# Altium schematic sheet CON_NB3000_ATE_INTF.SchDoc: ATE Interface Connector
size A4; Organization: Altium Limited.; Address1: Level 3, 12a Rodborough Rd; Address2: Frenchs Forest 2086; Address3: NSW; Address4: AUSTRALIA; DocumentNumber: 56; SheetNumber: 57; SheetTotal: 77
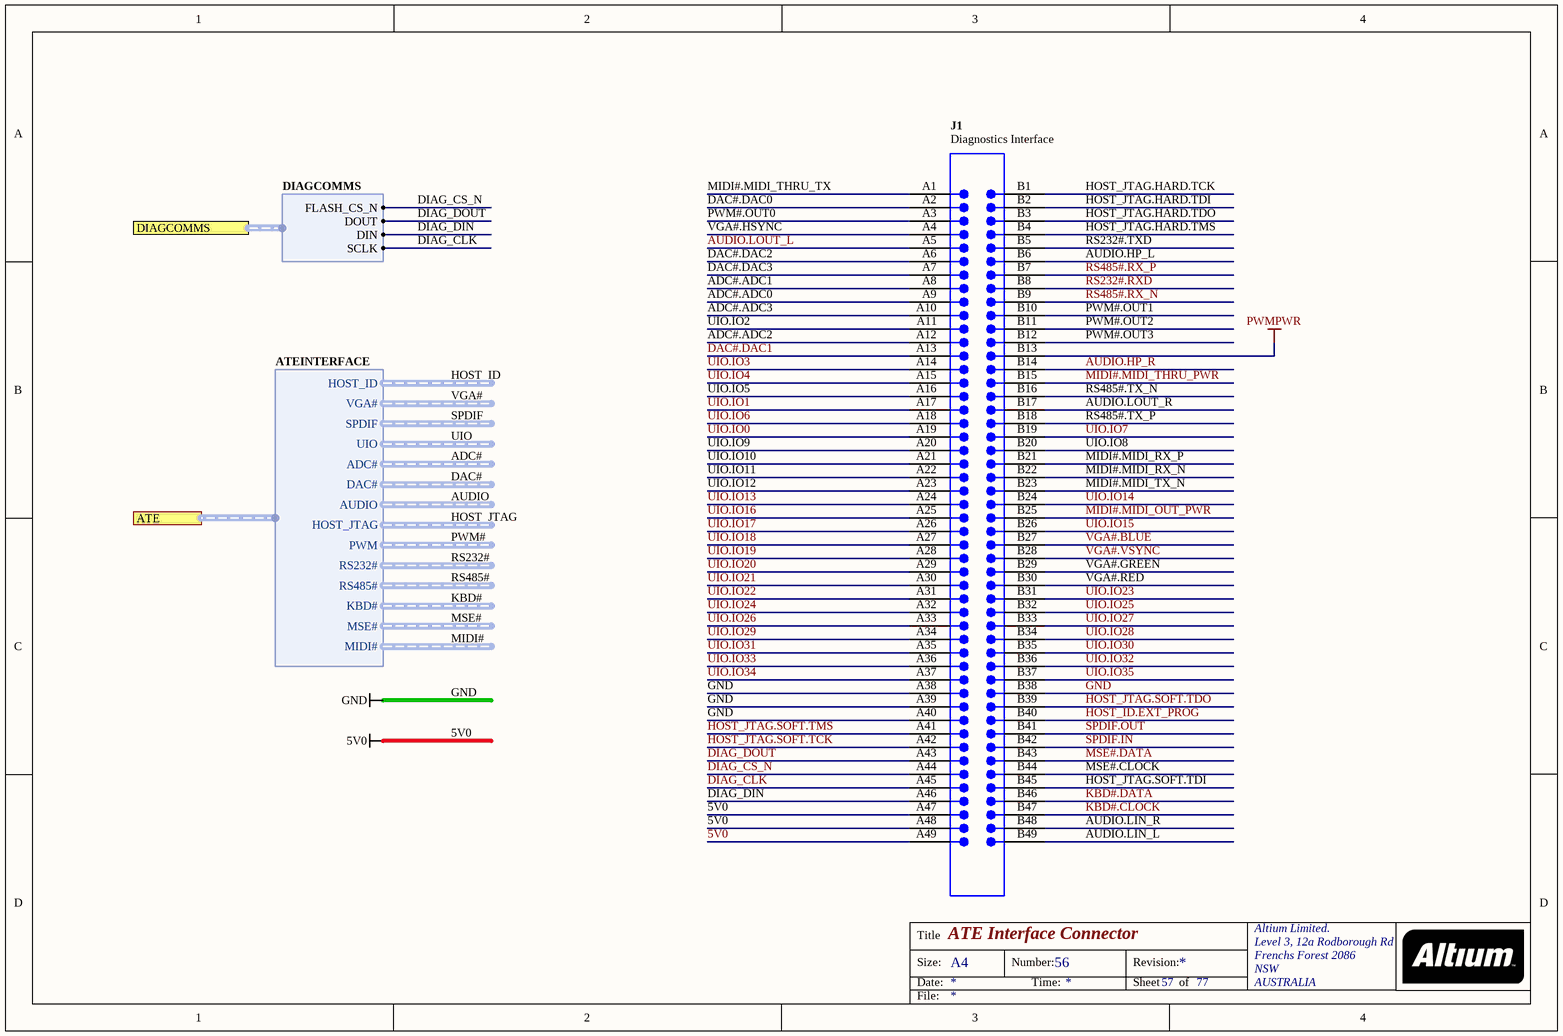
[diagram p0: CON_NB3000_ATE_INTF.SchDoc]

## Parts
J1  Diagnostics Interface  [EDGE-PCIE-X8]  (no BOM)

## Ports
ATE (harness ATEINTERFACE), DIAGCOMMS (harness DIAGCOMMS)

## Harnesses
DIAGCOMMS: DIN, DOUT, SCLK, FLASH_CS_N
ATEINTERFACE: VGA#, SPDIF, UIO, ADC#, DAC#, AUDIO, HOST_JTAG, PWM, RS232#, RS485#, KBD#, MSE#, MIDI#, HOST_ID

## Nets
5V0: J1.A47 J1.A48 J1.A49
GND: J1.A38 J1.A39 J1.A40 J1.B38
PWMPWR: J1.B13
ADC#.ADC0: J1.A9
ADC#.ADC1: J1.A8
ADC#.ADC2: J1.A12
ADC#.ADC3: J1.A10
AUDIO.HP_L: J1.B6
AUDIO.HP_R: J1.B14
AUDIO.LIN_L: J1.B49
AUDIO.LIN_R: J1.B48
AUDIO.LOUT_L: J1.A5
AUDIO.LOUT_R: J1.B17
DAC#.DAC0: J1.A2
DAC#.DAC1: J1.A13
DAC#.DAC2: J1.A6
DAC#.DAC3: J1.A7
DIAG_CLK: J1.A45 ; port DIAGCOMMS.SCLK
DIAG_CS_N: J1.A44 ; port DIAGCOMMS.FLASH_CS_N
DIAG_DIN: J1.A46 ; port DIAGCOMMS.DIN
DIAG_DOUT: J1.A43 ; port DIAGCOMMS.DOUT
HOST_ID.EXT_PROG: J1.B40
HOST_JTAG.HARD.TCK: J1.B1
HOST_JTAG.HARD.TDI: J1.B2
HOST_JTAG.HARD.TDO: J1.B3
HOST_JTAG.HARD.TMS: J1.B4
HOST_JTAG.SOFT.TCK: J1.A42
HOST_JTAG.SOFT.TDI: J1.B45
HOST_JTAG.SOFT.TDO: J1.B39
HOST_JTAG.SOFT.TMS: J1.A41
KBD#.CLOCK: J1.B47
KBD#.DATA: J1.B46
MIDI#.MIDI_OUT_PWR: J1.B25
MIDI#.MIDI_RX_N: J1.B22
MIDI#.MIDI_RX_P: J1.B21
MIDI#.MIDI_THRU_PWR: J1.B15
MIDI#.MIDI_THRU_TX: J1.A1
MIDI#.MIDI_TX_N: J1.B23
MSE#.CLOCK: J1.B44
MSE#.DATA: J1.B43
PWM#.OUT0: J1.A3
PWM#.OUT1: J1.B10
PWM#.OUT2: J1.B11
PWM#.OUT3: J1.B12
RS232#.RXD: J1.B8
RS232#.TXD: J1.B5
RS485#.RX_N: J1.B9
RS485#.RX_P: J1.B7
RS485#.TX_N: J1.B16
RS485#.TX_P: J1.B18
SPDIF.IN: J1.B42
SPDIF.OUT: J1.B41
UIO.IO0: J1.A19
UIO.IO1: J1.A17
UIO.IO2: J1.A11
UIO.IO3: J1.A14
UIO.IO4: J1.A15
UIO.IO5: J1.A16
UIO.IO6: J1.A18
UIO.IO7: J1.B19
UIO.IO8: J1.B20
UIO.IO9: J1.A20
UIO.IO10: J1.A21
UIO.IO11: J1.A22
UIO.IO12: J1.A23
UIO.IO13: J1.A24
UIO.IO14: J1.B24
UIO.IO15: J1.B26
UIO.IO16: J1.A25
UIO.IO17: J1.A26
UIO.IO18: J1.A27
UIO.IO19: J1.A28
UIO.IO20: J1.A29
UIO.IO21: J1.A30
UIO.IO22: J1.A31
UIO.IO23: J1.B31
UIO.IO24: J1.A32
UIO.IO25: J1.B32
UIO.IO26: J1.A33
UIO.IO27: J1.B33
UIO.IO28: J1.B34
UIO.IO29: J1.A34
UIO.IO30: J1.B35
UIO.IO31: J1.A35
UIO.IO32: J1.B36
UIO.IO33: J1.A36
UIO.IO34: J1.A37
UIO.IO35: J1.B37
VGA#.BLUE: J1.B27
VGA#.GREEN: J1.B29
VGA#.HSYNC: J1.A4
VGA#.RED: J1.B30
VGA#.VSYNC: J1.B28

## Notes on the sheet
- Title
- Size:
- Date:
- A4
- Number:
- Time:
- Revision:
- Sheet
- of
- File:

## Library data of the parts
J1 = D-300-0115: Connector, PCI Express, Used for Automatic Test Equipment (ATE); Connector type: Straight; Max Current: 1.1/pinA; Mounting Technology: Surface Mount; Pin Count: 98; Status: Unreleased; Category: Connector